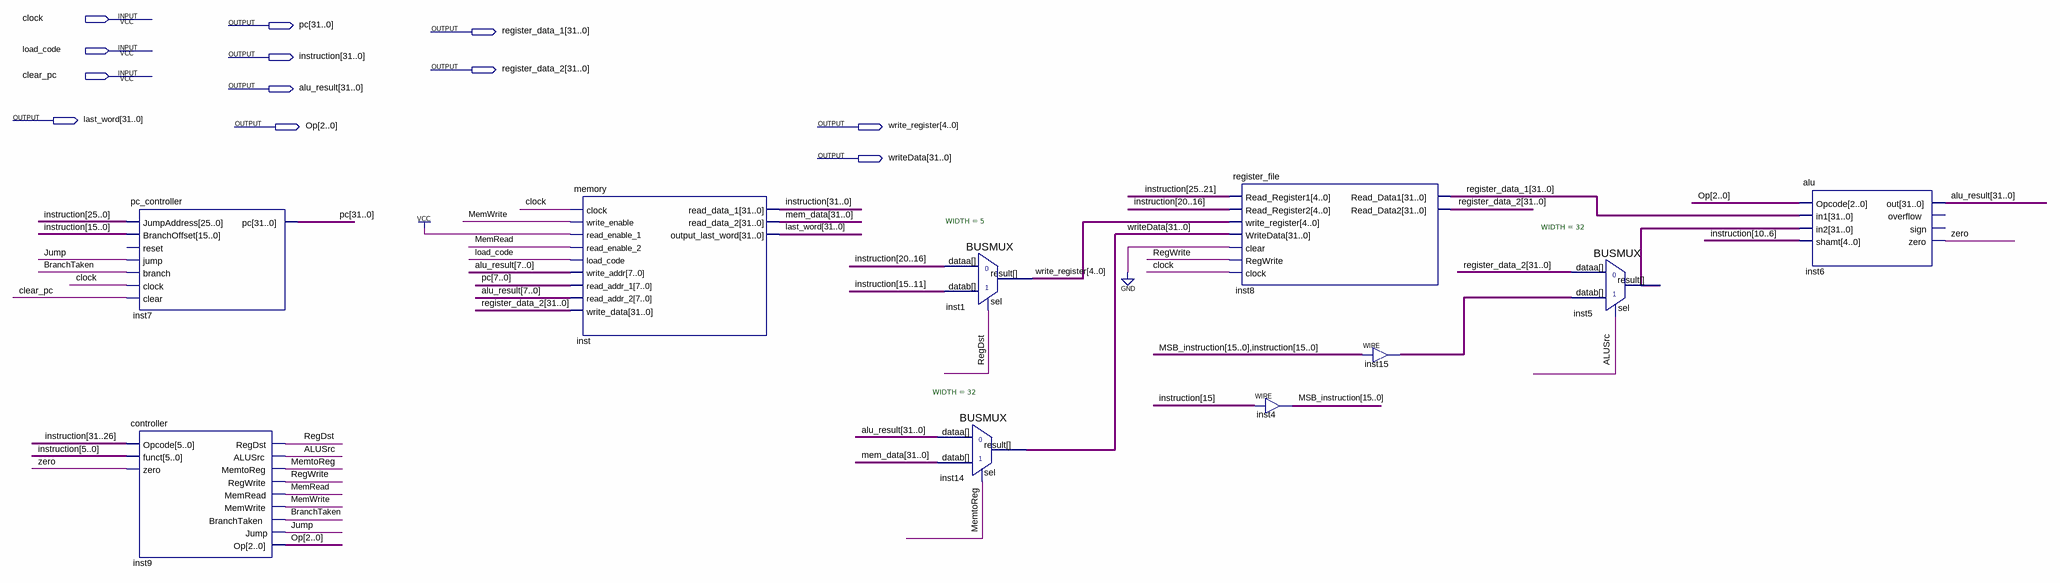
[diagram p0: schematic sheet]
// Quartus schematic proj5.bdf as structural Verilog: 10 symbols, 12 pins
module proj5 (
  input  clock,
  input  load_code,
  input  clear_pc,
  output [31:0] pc,
  output [31:0] register_data_1,
  output [31:0] instruction,
  output [31:0] register_data_2,
  output [31:0] alu_result,
  output [31:0] last_word,
  output [2:0] Op,
  output [4:0] write_register,
  output [31:0] writeData
);

  wire ALUSrc, BranchTaken, Jump, MemRead, MemtoReg, MemWrite, RegDst, RegWrite, zero;
  wire [15:0] MSB_instruction;
  wire [31:0] inst5_result, inst15_out, mem_data;

  pc_controller inst7 (
    .JumpAddress(instruction[25:0]), .BranchOffset(instruction[15:0]), .jump(Jump), .branch(BranchTaken),
    .clock(clock), .clear(clear_pc), .pc(pc));  // open: reset
  controller inst9 (
    .Opcode(instruction[31:26]), .funct(instruction[5:0]), .zero(zero), .RegDst(RegDst), .ALUSrc(ALUSrc),
    .MemtoReg(MemtoReg), .RegWrite(RegWrite), .MemRead(MemRead), .MemWrite(MemWrite),
    .BranchTaken(BranchTaken), .Jump(Jump), .Op(Op));
  memory inst (
    .clock(clock), .write_enable(MemWrite), .read_enable_1(1'b1), .read_enable_2(MemRead),
    .load_code(load_code), .write_addr(alu_result[7:0]), .read_addr_1(pc[7:0]),
    .read_addr_2(alu_result[7:0]), .write_data(register_data_2), .read_data_1(instruction),
    .read_data_2(mem_data), .output_last_word(last_word));
  BUSMUX #(.WIDTH(5)) inst1 (
    .datab(instruction[15:11]), .sel(RegDst), .dataa(instruction[20:16]), .result(write_register));
  BUSMUX #(.WIDTH(32)) inst14 (.datab(mem_data), .sel(MemtoReg), .dataa(alu_result), .result(writeData));
  register_file inst8 (
    .Read_Register1(instruction[25:21]), .Read_Register2(instruction[20:16]),
    .write_register(write_register), .WriteData(writeData), .clear(1'b0), .RegWrite(RegWrite), .clock(clock),
    .Read_Data1(register_data_1), .Read_Data2(register_data_2));
  assign MSB_instruction = {16{instruction[15]}};  // WIRE inst4
  assign inst15_out = {MSB_instruction, instruction[15:0]};  // WIRE inst15
  BUSMUX #(.WIDTH(32)) inst5 (.datab(inst15_out), .sel(ALUSrc), .dataa(register_data_2), .result(inst5_result));
  alu inst6 (
    .Opcode(Op), .in1(register_data_1), .in2(inst5_result), .shamt(instruction[10:6]), .out(alu_result),
    .zero(zero));  // open: overflow, sign
endmodule
